# Altium schematic sheet Ethernet2_RMII.SchDoc: Ethernet2 - RMII
size A3; Project: Project name; Date: Not used; ApprovedBy: Not used; CheckedBy: Not used; Author: Not used; CompanyName: STMicroelectronics; DrawnBy: Not used; Engineer: Not used; Organization: Not used; Address1: Not used; Address2: Not used; Address3: Not used; Address4: Not used; DocumentNumber: 8; Revision: Not used; SheetNumber: 8; SheetTotal: 17; CurrentTime: Not used; CurrentDate: Not used; Time: Not used; DocumentFullPathAndName: Not used; DocumentName: Not used; ModifiedDate: Not used; ImagePath: Not used; ProjectName: Not used; Application_BuildNumber: Not used
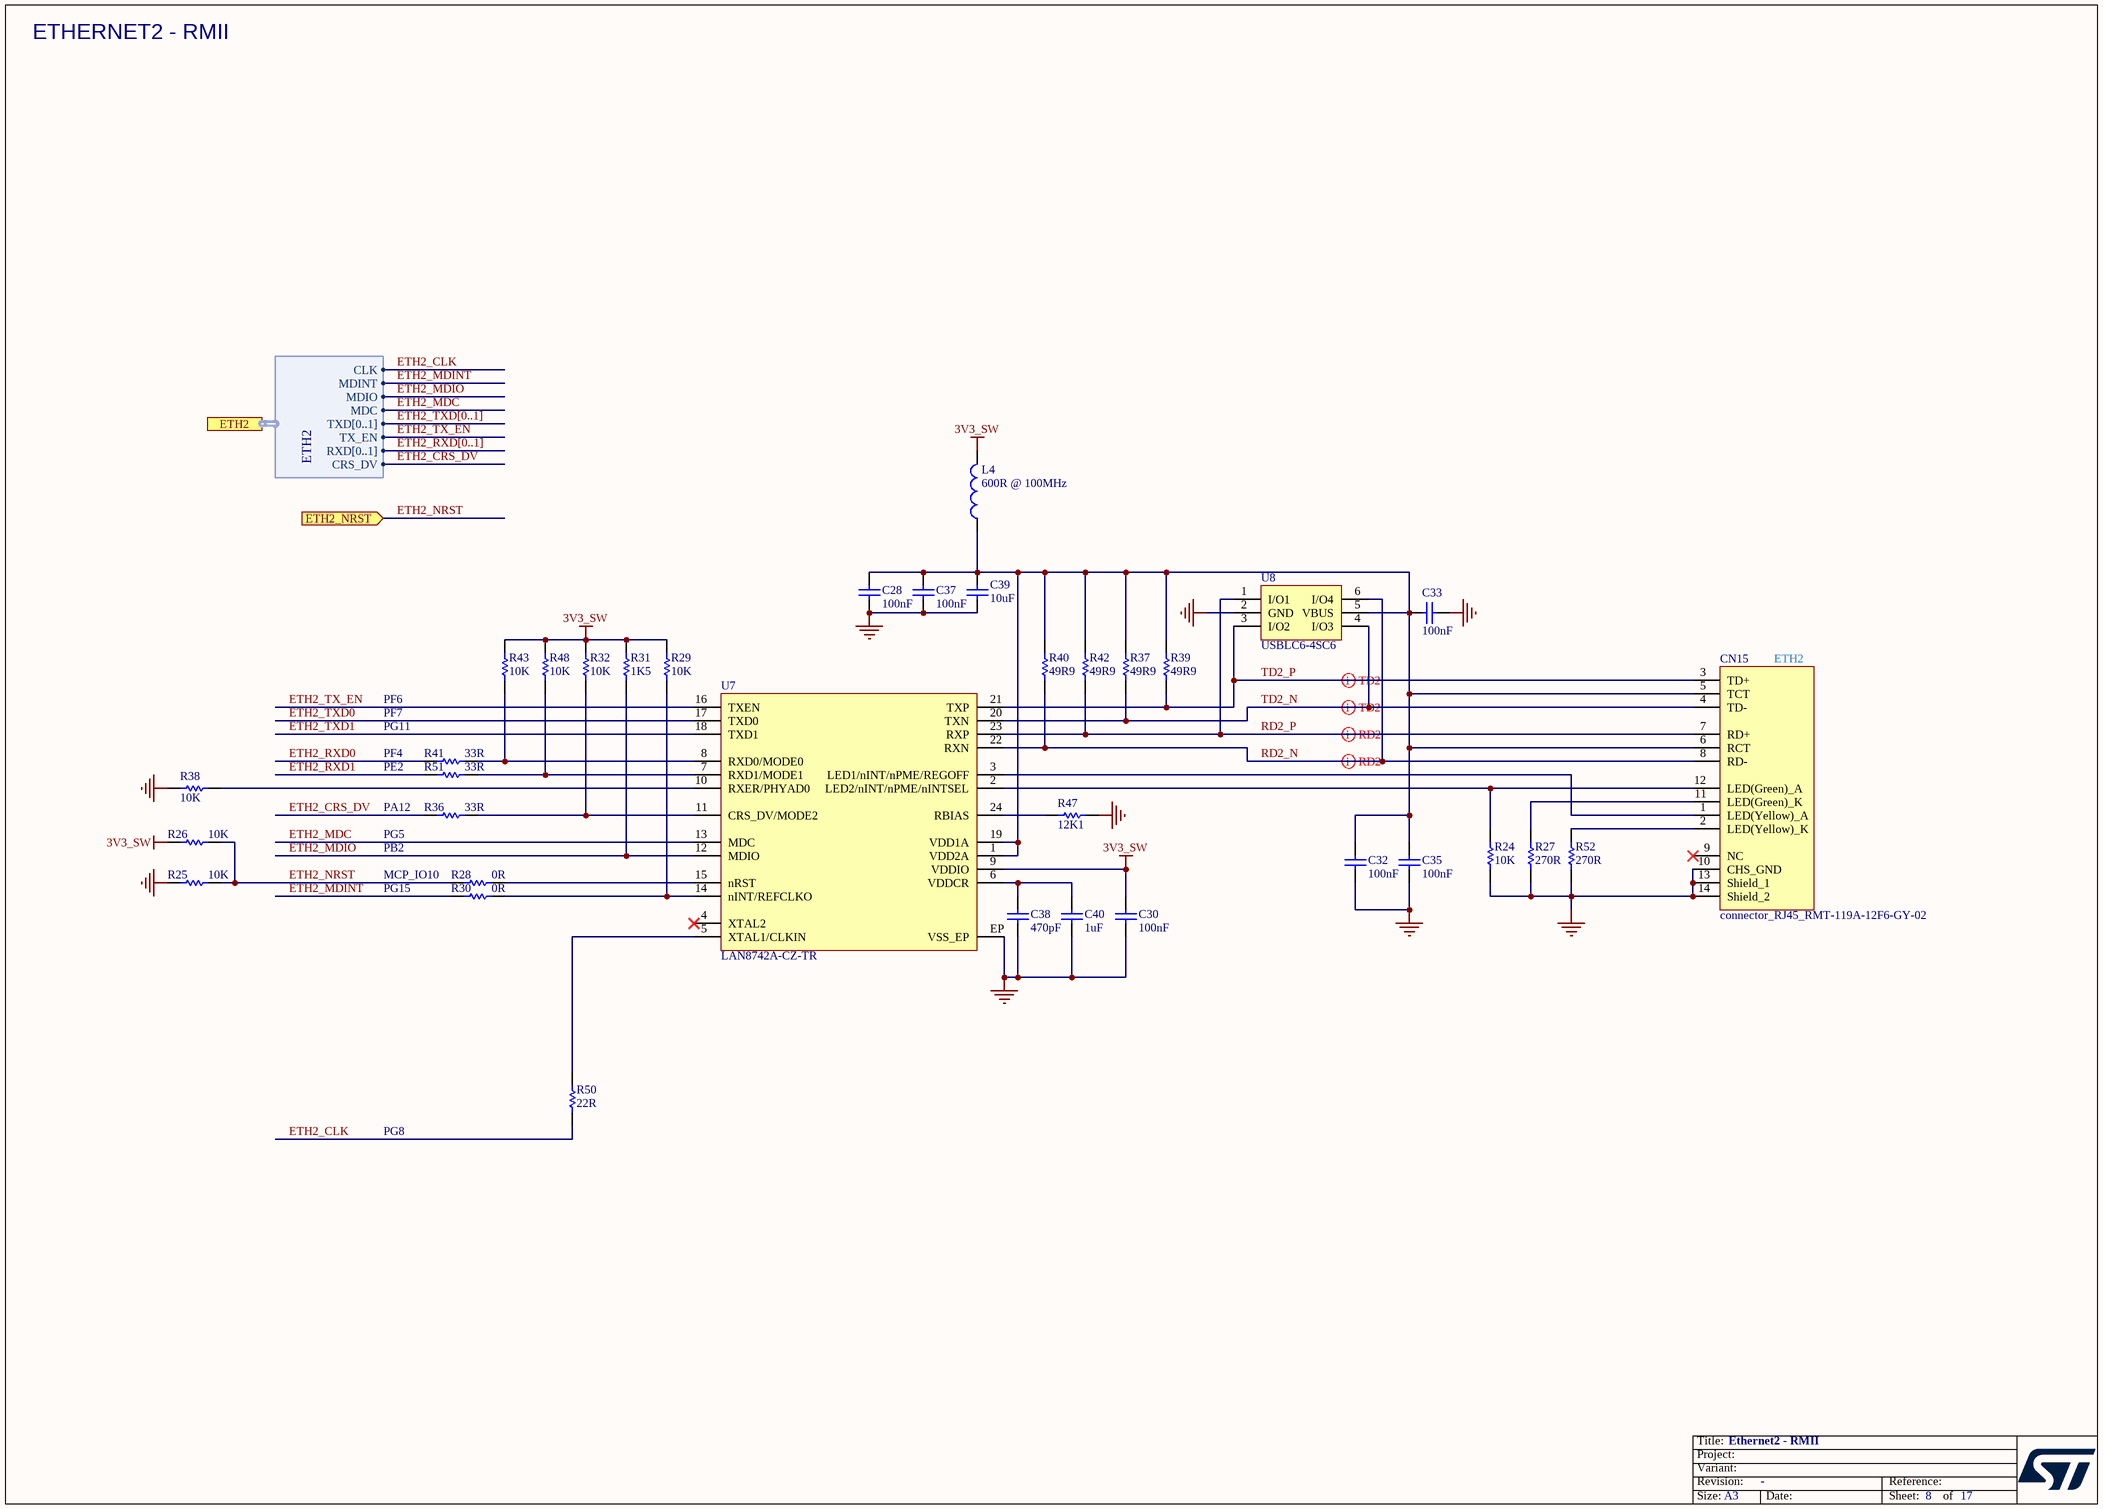
[diagram p0: Ethernet2_RMII.SchDoc]

## Parts
C28  value 100nF  [C0402]  (hidden comment: Capacitor)
C30  value 100nF  [C0402]  (hidden comment: Capacitor)
C32  value 100nF  [C0402]  (hidden comment: Capacitor)
C33  value 100nF  [C0402]  (hidden comment: Capacitor)
C35  value 100nF  [C0402]  (hidden comment: Capacitor)
C37  value 100nF  [C0402]  (hidden comment: Capacitor)
C38  value 470pF  [C0402]  (hidden comment: Capacitor)
C39  value 10uF  [C0603]  (hidden comment: Capacitor)
C40  value 1uF  [C0201_MURATA_GRM033_H0P3]  (hidden comment: Capacitor)
CN15  value connector_RJ45_RMT-119A-12F6-GY-02  [CON_RJ45_PHC_RMT-119A-12F6-GY-02]  (hidden comment: RJ45_RTS-119A-12F6-GY-02)
L4  value 600R @ 100MHz  [L0603]  (hidden comment: BEAD)
R24  value 10K  [R0402]  (hidden comment: Resistor)
R25  value 10K  [R0402]  (hidden comment: Resistor)
R26  value 10K  [R0402]  (hidden comment: Resistor)
R27  value 270R  [R0402]  (hidden comment: Resistor)
R28  value 0R  [R0402]  (hidden comment: Resistor)
R29  value 10K  [R0402]  (hidden comment: Resistor)
R30  value 0R  [R0402]  (hidden comment: Resistor)
R31  value 1K5  [R0402]  (hidden comment: Resistor)
R32  value 10K  [R0402]  (hidden comment: Resistor)
R36  value 33R  [R0402]  (hidden comment: Resistor)
R37  value 49R9  [R0402]  (hidden comment: Resistor)
R38  value 10K  [R0402]  (hidden comment: Resistor)
R39  value 49R9  [R0402]  (hidden comment: Resistor)
R40  value 49R9  [R0402]  (hidden comment: Resistor)
R41  value 33R  [R0402]  (hidden comment: Resistor)
R42  value 49R9  [R0402]  (hidden comment: Resistor)
R43  value 10K  [R0402]  (hidden comment: Resistor)
R47  value 12K1  [R0402]  (hidden comment: Resistor)
R48  value 10K  [R0402]  (hidden comment: Resistor)
R50  value 22R  [R0402]  (hidden comment: Resistor)
R51  value 33R  [R0402]  (hidden comment: Resistor)
R52  value 270R  [R0402]  (hidden comment: Resistor)
U7  LAN8742A-CZ-TR  [ICC_VQFN24-EPAD_4X4_P050]
U8  USBLC6-4SC6  [ESD_SOT23-6L]

## Ports
ETH2 (harness ETH2), ETH2_NRST (in)

## Harnesses
ETH2: MDINT, TXD[0..1], MDIO, MDC, TX_EN, RXD[0..1], CRS_DV, CLK

## Nets
3V3_SW: C30.2 L4.2 R26.2 R29.2 R31.2 R32.2 R43.2 R48.2 U7.9(VDDIO)
GND: C28.1 C30.1 C32.1 C33.2 C35.1 C37.1 C38.1 C39.2 C40.1 CN15.10(CHS_GND) CN15.13(Shield_1) CN15.14(Shield_2) R24.1 R25.2 R27.1 R38.2 R47.2 R52.1 U7.EP(VSS_EP) U8.2(GND)
ETH2_CLK: R50.1 ; port ETH2.CLK
ETH2_CRS_DV: R36.1 ; port ETH2.CRS_DV
ETH2_MDC: U7.13(MDC) ; port ETH2.MDC
ETH2_MDINT: R30.1 ; port ETH2.MDINT
ETH2_MDIO: R31.1 U7.12(MDIO) ; port ETH2.MDIO
ETH2_NRST: R25.1 R26.1 R28.1 ; port ETH2_NRST
ETH2_RXD0: R41.1
ETH2_RXD1: R51.1
ETH2_TX_EN: U7.16(TXEN) ; port ETH2.TX_EN
ETH2_TXD0: U7.17(TXD0)
ETH2_TXD1: U7.18(TXD1)
RD2_N: CN15.8(RD-) R40.1 U7.22(RXN) U8.6(I/O4)
RD2_P: CN15.7(RD+) R42.1 U7.23(RXP) U8.1(I/O1)
TD2_N: CN15.4(TD-) R37.1 U7.20(TXN) U8.4(I/O3)
TD2_P: CN15.3(TD+) R39.1 U7.21(TXP) U8.3(I/O2)
NetC28_2: C28.2 C32.2 C33.1 C35.2 C37.2 C39.1 CN15.5(TCT) CN15.6(RCT) L4.1 R37.2 R39.2 R40.2 R42.2 U7.1(VDD2A) U7.19(VDD1A) U8.5(VBUS)
NetC38_2: C38.2 C40.2 U7.6(VDDCR)
NetCN15_1: CN15.1(LED(Yellow)_A) U7.3(LED1/nINT/nPME/REGOFF)
NetCN15_2: CN15.2(LED(Yellow)_K) R52.2
NetCN15_11: CN15.11(LED(Green)_K) R27.2
NetCN15_12: CN15.12(LED(Green)_A) R24.2 U7.2(LED2/nINT/nPME/nINTSEL)
NetR28_2: R28.2 U7.15(nRST)
NetR29_1: R29.1 R30.2 U7.14(nINT/REFCLKO)
NetR32_1: R32.1 R36.2 U7.11(CRS_DV/MODE2)
NetR38_1: R38.1 U7.10(RXER/PHYAD0)
NetR41_2: R41.2 R43.1 U7.8(RXD0/MODE0)
NetR47_1: R47.1 U7.24(RBIAS)
NetR48_1: R48.1 R51.2 U7.7(RXD1/MODE1)
NetR50_2: R50.2 U7.5(XTAL1/CLKIN)

Not connected (* = marked no-connect by the designer): CN15 9(NC)*; U7 4(XTAL2)*

## Buses and harness runs
bus ETH2_RXD[0..1]
bus ETH2_TXD[0..1]

## Layout directives
differential pair: RD2_N, RD2_P, TD2_N, TD2_P

## Notes on the sheet
- ETHERNET2 - RMII
- PF6
- PF7
- ETH2
- PF4
- PE2
- PG11
- PA12
- (near R36) PG5
- PB2
- PG15
- MCP_IO10
- PG8
- Title:
- Project:
- Size:
- Revision:
- Variant:
- A3
- -
- Date:
- Reference:
- Sheet:
- of

## Library data of the parts
C28 C30 C32 C33 C35 C37 = MCD-00006: Capacitor, MLCC, 100nF, 16V, X7R, +/-10%, 0402, T=0.5mm; Manufacturer_Part_Number: CC0402KRX7R7BB104; Manufacturer: YAGEO; Part_Preference: Recommended; Order_Code_RS: 616-9701; Component_Country_Of_Origin: China; ShowFields: YES; ID: 2474; Internal_Part_Number: MCD-00006; Status: Released; Part_Type: Capacitor; Package: 0402; ComponentLink1URL: http://tunmcdsvn.tun.st.com/Component_Documentation_Library/Trunk/Capacitor/YAGEO_X7R_Series; Order_Code_Digikey: 311-1338-1-ND; Order_Code_Farnell: 9402047
C38 = MCD-00724: Capacitor, MLCC, 470pF, 50V, NPO, +/-5%, 0402, T=0.5mm; Manufacturer_Part_Number: CC0402JRNPO9BN471; Manufacturer: YAGEO; Part_Preference: Recommended; Order_Code_RS: 199-2186; Component_Country_Of_Origin: China; ShowFields: YES; ID: 3023; Internal_Part_Number: MCD-00724; Status: Released; Part_Type: Capacitor; Package: 0402; ComponentLink1URL: http://tunmcdsvn.tun.st.com/Component_Documentation_Library/Trunk/Capacitor/YAGEO_NP0_Series; Order_Code_Digikey: 311-1671-1-ND; Order_Code_Farnell: 3366416
C39 = MCD-00099: Capacitor, MLCC, 10uF, 10V, X5R, +/-10%, 0603, T=0.8mm; Manufacturer_Part_Number: GRM188R61A106KE69D; Manufacturer: MURATA; Part_Preference: Recommended; Order_Code_RS: 170-6168; Component_Country_Of_Origin: Japan; ShowFields: YES; ID: 2770; Internal_Part_Number: MCD-00099; Status: Released; Part_Type: Capacitor; Package: 0603; ComponentLink1URL: http://tunmcdsvn.tun.st.com/Component_Documentation_Library/Trunk/Capacitor/MURATA_GRM_Series; Order_Code_Digikey: 490-10474-1-ND; Order_Code_Farnell: 2494233
C40 = MCD-02377: Capacitor, MLCC, 1uF, 6.3V, X5R, +/-20%, 0201, T=0,3mm; Manufacturer_Part_Number: GRM033R60J105MEA2; Manufacturer: MURATA; Part_Preference: Recommended; Order_Code_RS: 820-0643; Component_Country_Of_Origin: Japan; ShowFields: YES; ID: 4483; Internal_Part_Number: MCD-02377; Status: Checked; Part_Type: Capacitor; Package: 0201; ComponentLink1URL: http://tunmcdsvn.tun.st.com/Component_Documentation_Library/Trunk/Capacitor/MURATA_GRM_Series/GRM033R60J105MEA2/; Order_Code_Digikey: 490-7229-2-ND; Order_Code_Farnell: 2470448
CN15 = MCD-02475: connector_RJ45, 10/100 Ethernet integrated MAG with integrate Green and Yellow LED, T= 13.61mm; Part_Preference: Recommended; Manufacturer: PENGHUI; Manufacturer_Part_Number: RMT-119A-12F6-GY-02; ShowFields: YES; ID: 4581; Internal_Part_Number: MCD-02475; Status: Released; Part_Type: Connector; ComponentLink1URL: http://tunmcdsvn.tun.st.com/Component_Documentation_Library/Trunk/Connector/PENGHUI_RMT-119A-12F6-GY-02; Order_Code_Digikey: N/A; Order_Code_Farnell: N/A; Order_Code_RS: N/A
L4 = MCD-00047: Ferrite bead, 600R @1 00MHz, +/-25%, 350mA, 0R5, 0603, T=0.8mm; Part_Type: Inductor; Manufacturer_Part_Number: FCM1608KF-601T03; Manufacturer: TAI-TECH; Part_Preference: Recommended; Component_Country_Of_Origin: Unknown; ShowFields: YES; ID: 2546; Internal_Part_Number: MCD-00047; Status: Released; ComponentLink1URL: http://tunmcdsvn.tun.st.com/Component_Documentation_Library/Trunk/Inductor/TAI-TECH_FCM-1608_Series; Package: 0603; Order_Code_Digikey: N/A; Order_Code_Farnell: N/A; Order_Code_RS: N/A
R24 R29 R32 R38 R43 R48 = MCD-00053: Resistor, 10K, 0402, +/-1%, 1/16W; Manufacturer_Part_Number: RC0402FR-0710KL; Manufacturer: YAGEO; BMS_Part_Number: 9131590; Part_Preference: Recommended; Component_Country_Of_Origin: China; ShowFields: YES; ID: 2539; Internal_Part_Number: MCD-00053; Status: Released; Part_Type: Resistor; Package: 0402; ComponentLink1URL: http://tunmcdsvn.tun.st.com/Component_Documentation_Library/Trunk/Resistor/YAGEO_RC_L_Series; Order_Code_Digikey: 311-10.0KLRCT-ND; Order_Code_Farnell: 9239359; Order_Code_RS: N/A
R25 R26 = MCD-00053: Resistor, 10K, 0402, +/-1%, 1/16W; Manufacturer_Part_Number: RC0402FR-0710KL; Manufacturer: YAGEO; Part_Preference: Recommended; BMS_Part_Number: 9131590; Component_Country_Of_Origin: China; ShowFields: YES; ID: 2539; Internal_Part_Number: MCD-00053; Status: Released; Part_Type: Resistor; Package: 0402; ComponentLink1URL: http://tunmcdsvn.tun.st.com/Component_Documentation_Library/Trunk/Resistor/YAGEO_RC_L_Series; Order_Code_Digikey: 311-10.0KLRCT-ND; Order_Code_Farnell: 9239359; Order_Code_RS: N/A
R27 R52 = MCD-00441: Resistor, 270R, 0402, +/-1%, 1/16W; Manufacturer_Part_Number: RC0402FR-07270RL; Manufacturer: YAGEO; Part_Preference: Recommended; Component_Country_Of_Origin: China; ShowFields: YES; ID: 2838; Internal_Part_Number: MCD-00441; Status: Released; Part_Type: Resistor; Package: 0402; ComponentLink1URL: http://tunmcdsvn.tun.st.com/Component_Documentation_Library/Trunk/Resistor/YAGEO_RC_L_Series; Order_Code_Digikey: 311-270LRCT-ND; Order_Code_Farnell: 9239162; Order_Code_RS: N/A
R28 = MCD-00052: Resistor, 0R, 0402, +/-5%, 1/16W; Part_Preference: Recommended; Manufacturer: YAGEO; Manufacturer_Part_Number: RC0402JR-070RL; Order_Code_RS: 618-5804; Component_Country_Of_Origin: China; ShowFields: YES; ID: 2540; Internal_Part_Number: MCD-00052; Status: Released; Part_Type: Resistor; Package: 0402; ComponentLink1URL: http://tunmcdsvn.tun.st.com/Component_Documentation_Library/Trunk/Resistor/YAGEO_RC_L_Series; Order_Code_Digikey: 311-0.0JRCT-ND; Order_Code_Farnell: 9232516RL
R30 = MCD-00052: Resistor, 0R, 0402, +/-5%, 1/16W; Manufacturer_Part_Number: RC0402JR-070RL; Manufacturer: YAGEO; Part_Preference: Recommended; Order_Code_RS: 618-5804; Component_Country_Of_Origin: China; ShowFields: YES; ID: 2540; Internal_Part_Number: MCD-00052; Status: Released; Part_Type: Resistor; Package: 0402; ComponentLink1URL: http://tunmcdsvn.tun.st.com/Component_Documentation_Library/Trunk/Resistor/YAGEO_RC_L_Series; Order_Code_Digikey: 311-0.0JRCT-ND; Order_Code_Farnell: 9232516RL
R31 = MCD-00068: Resistor, 1K5, 0402, +/-1%, 1/16W; Manufacturer_Part_Number: RC0402FR-071K5L; Manufacturer: YAGEO; Part_Preference: Recommended; Component_Country_Of_Origin: China; ShowFields: YES; ID: 2524; Internal_Part_Number: MCD-00068; Status: Released; Part_Type: Resistor; Package: 0402; ComponentLink1URL: http://tunmcdsvn.tun.st.com/Component_Documentation_Library/Trunk/Resistor/YAGEO_RC_L_Series; Order_Code_Digikey: 311-1.50KLRCT-ND; Order_Code_Farnell: 9239251; Order_Code_RS: N/A
R36 R41 R51 = MCD-00455: Resistor, 33R, 0402, +/-1%, 1/16W; Manufacturer_Part_Number: RC0402FR-0733RL; Manufacturer: YAGEO; Part_Preference: Recommended; Component_Country_Of_Origin: China; ShowFields: YES; ID: 2821; Internal_Part_Number: MCD-00455; Status: Released; Part_Type: Resistor; Package: 0402; ComponentLink1URL: http://tunmcdsvn.tun.st.com/Component_Documentation_Library/Trunk/Resistor/YAGEO_RC_L_Series; Order_Code_Digikey: 311-33.0LRCT-ND; Order_Code_Farnell: 9239057; Order_Code_RS: N/A
R37 R39 R40 R42 = MCD-00565: Resistor, 49R9, 0402, +/-1%, 1/16W; Manufacturer_Part_Number: RC0402FR-0749R9L; Manufacturer: YAGEO; Part_Preference: Recommended; Component_Country_Of_Origin: China; ShowFields: YES; ID: 3178; Internal_Part_Number: MCD-00565; Status: Released; Part_Type: Resistor; Package: 0402; ComponentLink1URL: http://tunmcdsvn.tun.st.com/Component_Documentation_Library/Trunk/Resistor/YAGEO_RC_L_Series; Order_Code_Digikey: 311-49.9LRCT-ND; Order_Code_Farnell: 1799218; Order_Code_RS: N/A
R47 = MCD-00723: Resistor, 12K1, 0402, +/-1%, 1/16W; Manufacturer_Part_Number: RC0402FR-0712K1L; Manufacturer: YAGEO; Part_Preference: Recommended; Component_Country_Of_Origin: China; ShowFields: YES; ID: 3022; Internal_Part_Number: MCD-00723; Status: Released; Part_Type: Resistor; Package: 0402; ComponentLink1URL: http://tunmcdsvn.tun.st.com/Component_Documentation_Library/Trunk/Resistor/YAGEO_RC_L_Series; Order_Code_Digikey: 311-12.1KLRCT-ND; Order_Code_Farnell: 1799183; Order_Code_RS: N/A
R50 = MCD-00189: Resistor, 22R, 0402, +/-1%, 1/16W; Manufacturer_Part_Number: RC0402FR-0722RL; Manufacturer: YAGEO; Part_Preference: Recommended; Component_Country_Of_Origin: China; ShowFields: YES; ID: 2677; Internal_Part_Number: MCD-00189; Status: Released; Part_Type: Resistor; ComponentLink1URL: http://tunmcdsvn.tun.st.com/Component_Documentation_Library/Trunk/Resistor/YAGEO_RC_L_Series; Package: 0402; Order_Code_Digikey: 311-22.0LRCT-ND; Order_Code_Farnell: 9239030; Order_Code_RS: N/A
U7 = MCD-00719: 10/100M RMII Ethernet transceiver; Part_Type: IC; Manufacturer: MICROCHIP; BMS_Part_Number: 9177984; Part_Preference: Recommended; Component_Country_Of_Origin: Unknown; ShowFields: YES; ID: 3026; Internal_Part_Number: MCD-00719; Value: LAN8742A-CZ-TR; Status: Released; Manufacturer_Part_Number: LAN8742A-CZ-TR; ComponentLink1URL: http://tunmcdsvn.tun.st.com/Component_Datasheet_Library/Trunk/IC/MICROCHIP_LAN8742A_RMII_PHY
U8 = MCD-00250: Very low capacitance ESD protection , 4 lines; Part_Type: IC; Manufacturer: STMICROELECTRONICS; BMS_Part_Number: 9151001; Part_Preference: Recommended; Manufacturer_HQ_COO: EU; Component_Country_Of_Origin: China; ShowFields: YES; ID: 2616; Internal_Part_Number: MCD-00250; Value: USBLC6-4SC6; Status: Released; Manufacturer_Part_Number: USBLC6-4SC6; ComponentLink1URL: http://tunmcdsvn.tun.st.com/Component_Datasheet_Library/Trunk/Diodes/STM_ESD_USBLC6-4SC6